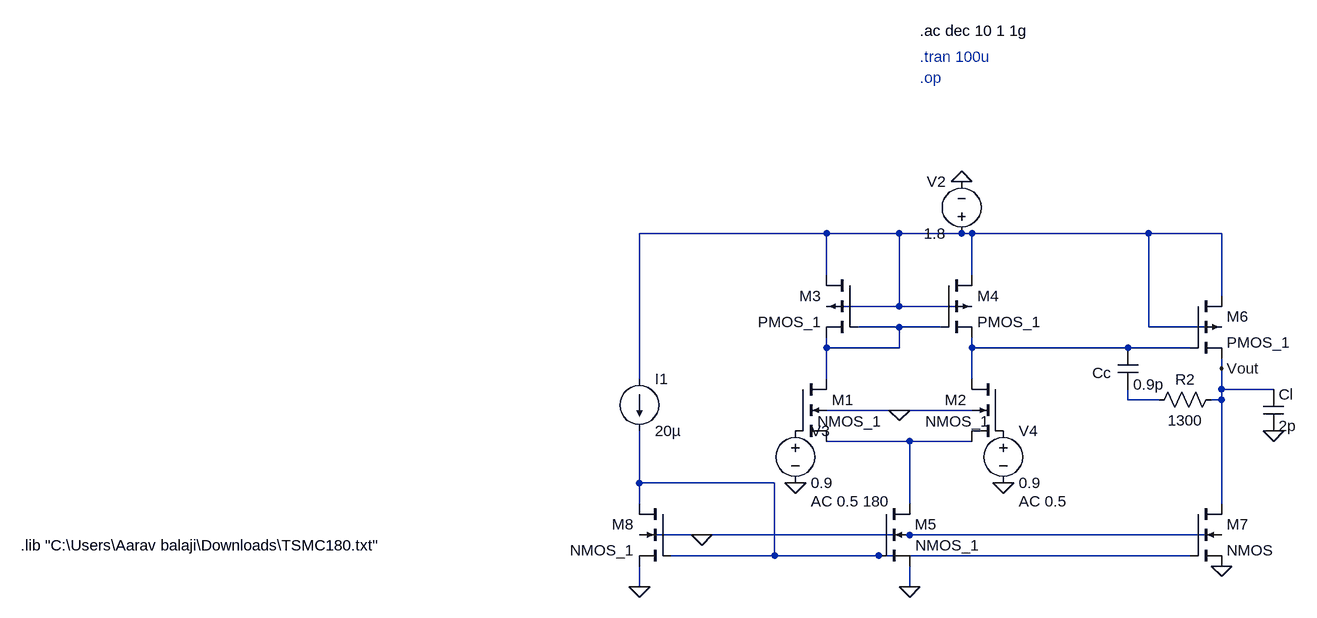
[diagram p0: schematic 2 Stage OTA.asc]
2 Stage OTA.asc, the LTspice schematic file:
Version 4.1
SHEET 1 1340 780
WIRE 512 -224 224 -224
WIRE 624 -224 512 -224
WIRE 720 -224 624 -224
WIRE 736 -224 720 -224
WIRE 1008 -224 736 -224
WIRE 1120 -224 1008 -224
WIRE 512 -160 512 -224
WIRE 736 -160 736 -224
WIRE 1120 -128 1120 -224
WIRE 624 -112 624 -224
WIRE 624 -112 512 -112
WIRE 736 -112 624 -112
WIRE 624 -80 560 -80
WIRE 688 -80 624 -80
WIRE 1008 -80 1008 -224
WIRE 1120 -80 1008 -80
WIRE 512 -48 512 -64
WIRE 624 -48 624 -80
WIRE 624 -48 512 -48
WIRE 736 -48 736 -64
WIRE 976 -48 736 -48
WIRE 1072 -48 976 -48
WIRE 1120 -16 1120 -32
WIRE 224 0 224 -224
WIRE 512 0 512 -48
WIRE 736 0 736 -48
WIRE 1120 16 1120 -16
WIRE 1200 16 1120 16
WIRE 976 32 976 16
WIRE 1024 32 976 32
WIRE 1120 32 1120 16
WIRE 1120 32 1104 32
WIRE 624 48 512 48
WIRE 736 48 624 48
WIRE 640 96 512 96
WIRE 736 96 640 96
WIRE 224 160 224 80
WIRE 432 160 224 160
WIRE 224 192 224 160
WIRE 640 192 640 96
WIRE 1120 192 1120 32
WIRE 320 240 224 240
WIRE 640 240 320 240
WIRE 1120 240 640 240
WIRE 432 272 432 160
WIRE 432 272 272 272
WIRE 592 272 432 272
WIRE 1072 272 592 272
WIRE 224 320 224 288
WIRE 640 320 640 288
FLAG 624 48 0
FLAG 640 320 0
FLAG 320 240 0
FLAG 1120 288 0
FLAG 1200 80 0
FLAG 1120 -16 Vout
FLAG 720 -304 0
FLAG 464 160 0
FLAG 784 160 0
FLAG 224 320 0
SYMBOL nmos4 464 0 R0
WINDOW 3 34 65 Left 2
SYMATTR Value NMOS_1
SYMATTR InstName M1
SYMATTR Value2 l=1u w=3.1u
SYMBOL nmos4 784 0 M0
WINDOW 3 21 65 Left 2
SYMATTR Value NMOS_1
SYMATTR InstName M2
SYMATTR Value2 l=1u w=3.1u
SYMBOL pmos4 560 -160 M0
SYMATTR InstName M3
SYMATTR Value PMOS_1
SYMATTR Value2 l=1u w=6u
SYMBOL pmos4 688 -160 R0
SYMATTR InstName M4
SYMATTR Value PMOS_1
SYMATTR Value2 l=1u w=6u
SYMBOL current 224 0 R0
WINDOW 123 0 0 Left 0
WINDOW 39 0 0 Left 0
SYMATTR InstName I1
SYMATTR Value 20µ
SYMBOL nmos4 272 192 M0
SYMATTR InstName M8
SYMATTR Value NMOS_1
SYMATTR Value2 l=1u w=22u
SYMBOL nmos4 592 192 R0
WINDOW 3 57 64 Left 2
SYMATTR Value NMOS_1
SYMATTR InstName M5
SYMATTR Value2 l=1u w=4.35u
SYMBOL pmos4 1072 -128 R0
SYMATTR InstName M6
SYMATTR Value PMOS_1
SYMATTR Value2 l=1u w=9u m=18
SYMBOL nmos4 1072 192 R0
SYMATTR InstName M7
SYMATTR Value2 l=1u w=5.5u m=4
SYMBOL res 1120 16 R90
WINDOW 0 0 56 VBottom 2
WINDOW 3 32 56 VTop 2
SYMATTR InstName R2
SYMATTR Value 1300
SYMBOL cap 960 -48 R0
WINDOW 0 -39 39 Left 2
SYMATTR InstName Cc
SYMATTR Value 0.9p
SYMBOL cap 1184 16 R0
SYMATTR InstName Cl
SYMATTR Value 2p
SYMBOL voltage 720 -208 R180
WINDOW 0 24 96 Left 2
WINDOW 3 24 16 Left 2
SYMATTR InstName V2
SYMATTR Value 1.8
SYMBOL voltage 464 64 R0
WINDOW 123 24 124 Left 2
WINDOW 39 0 0 Left 0
SYMATTR InstName V3
SYMATTR Value 0.9
SYMATTR Value2 AC 0.5 180
SYMBOL voltage 784 64 R0
WINDOW 123 24 124 Left 2
WINDOW 39 0 0 Left 0
SYMATTR InstName V4
SYMATTR Value 0.9
SYMATTR Value2 AC 0.5
TEXT -728 256 Left 2 !.lib "C:\\Users\\Aarav balaji\\Downloads\\TSMC180.txt"
TEXT 656 -464 Left 2 ;.op
TEXT 656 -536 Left 2 !.ac dec 10 1 1g
TEXT 656 -496 Left 2 ;.tran 100u

The netlist it stands for:
* 2 Stage OTA.asc
M1 N002 P001 N005 0 NMOS_1 l=1u w=3.1u
M2 N003 P002 N005 0 NMOS_1 l=1u w=3.1u
M3 N001 N002 N002 N001 PMOS_1 l=1u w=6u
M4 N001 N002 N003 N001 PMOS_1 l=1u w=6u
I1 N001 N006 20µ
M8 N006 N006 0 0 NMOS_1 l=1u w=22u
M5 N005 N006 0 0 NMOS_1 l=1u w=4.35u
M6 N001 N003 Vout N001 PMOS_1 l=1u w=9u m=18
M7 Vout N006 0 0 NMOS l=1u w=5.5u m=4
R2 Vout N004 1300
Cc N003 N004 0.9p
Cl Vout 0 2p
V2 N001 0 1.8
V3 P001 0 0.9 AC 0.5 180
V4 P002 0 0.9 AC 0.5
.model NMOS NMOS
.model PMOS PMOS
.lib standard.mos
.lib "C:\Users\Aarav balaji\Downloads\TSMC180.txt"
* .op
.ac dec 10 1 1g
* .tran 100u
.backanno
.end